# Altium project project_circuit_de_puissance.PrjPcb
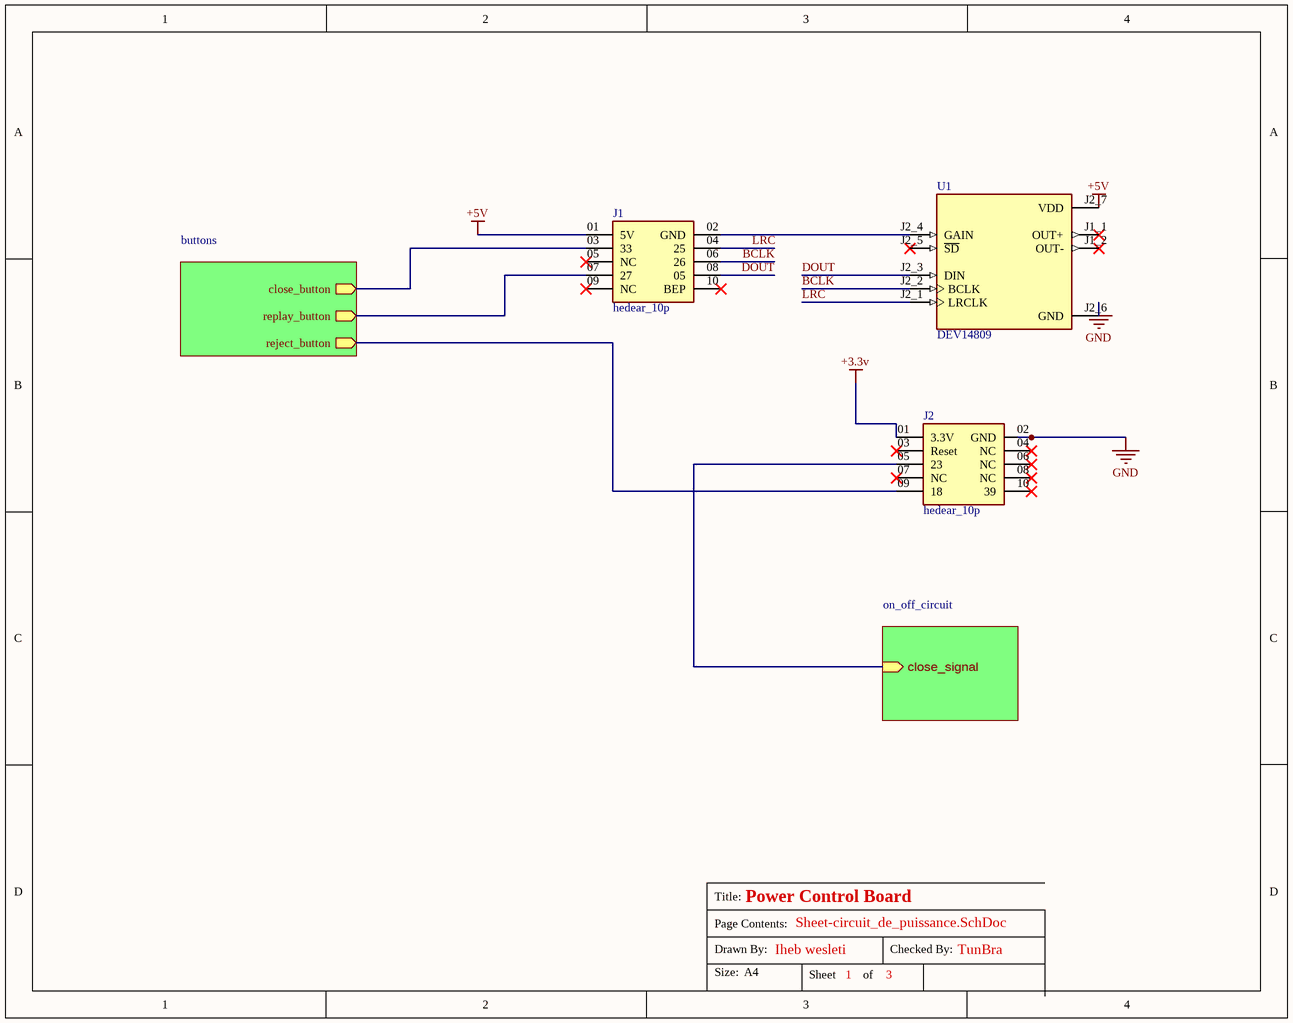
[diagram p0: Sheet-circuit_de_puissance.SchDoc]
3 sheets, 24 parts. Net scope: hierarchical (ports join the sheet entries above them; power ports are global).
Board file: pcb_circuit_de_puissance.PcbDoc
Sheets:
  Sheet-circuit_de_puissance.SchDoc
    on_off_circuit = circuit_on_off.SchDoc
    buttons = buttons.SchDoc

## Sheet Sheet-circuit_de_puissance.SchDoc: Power Control Board
size A; CheckedBy: TunBra; DrawnBy: Iheb wesleti; SheetNumber: 1; SheetTotal: 3; Number: 3

### Parts
J1  hedear_10p  [hedear10p]
J2  hedear_10p  [hedear10p]
U1  DEV14809  [MODULEson_DEV14809]

### Sub-sheets
buttons = buttons: close_button (out), replay_button (out), reject_button (out)
on_off_circuit = circuit_on_off: close_signal (in)

### Nets
+3.3v: J2.01(3.3V)
+5V: J1.01(5V) U1.J2_7(VDD)
GND: J2.02(GND) U1.J2_6(GND)
BCLK: J1.06(26) U1.J2_2(BCLK)
DOUT: J1.08(05) U1.J2_3(DIN)
LRC: J1.04(25) U1.J2_1(LRCLK)
NetC1_1: J1.03(33) ; sheet buttons/close_button
NetC3_2: J1.07(27) ; sheet buttons/replay_button
NetC4_2: J2.09(18) ; sheet buttons/reject_button
NetJ1_02: J1.02(GND) U1.J2_4(GAIN)
NetJ2_05: J2.05(23) ; sheet on_off_circuit/close_signal

Not connected (* = marked no-connect by the designer): J1 05(NC)* 09(NC)* 10(BEP)*; J2 03(Reset)* 04(NC)* 06(NC)* 07(NC)* 08(NC)* 10(39)*; U1 J1_1(OUT+)* J1_2(OUT-)* J2_5(~{SD})*

### Notes on the sheet
- Title:
- Size:
- Drawn By:
- Page Contents:
- A4
- Sheet
- of
- Checked By:
- 3

### Library data of the parts
J1 = hedear_10p: MP: TSS-105-02-L-D; Package: None; Price: None; Value: *; Availability: Unavailable
J2 = hedear_10p_1: MP: TSS-105-02-L-D; Package: None; Price: None; Value: *; Availability: Unavailable
U1 = DEV14809: MAX98357A Audio Interface Audio - Platform Evaluation Expansion Board; MF: Sparkfun Electronics; SnapEDA_Link: https://www.snapeda.com/parts/DEV14809/SparkFun+Electronics/view-part/?ref=snap; Package: None; Value: *; MP: DEV14809; Check_prices: https://www.snapeda.com/parts/DEV14809/SparkFun+Electronics/view-part/?ref=eda

## Sheet circuit_on_off.SchDoc: Power Control Board
size A; CheckedBy: TunBra; DrawnBy: Iheb Wesleti; SheetNumber: 2; SheetTotal: 3
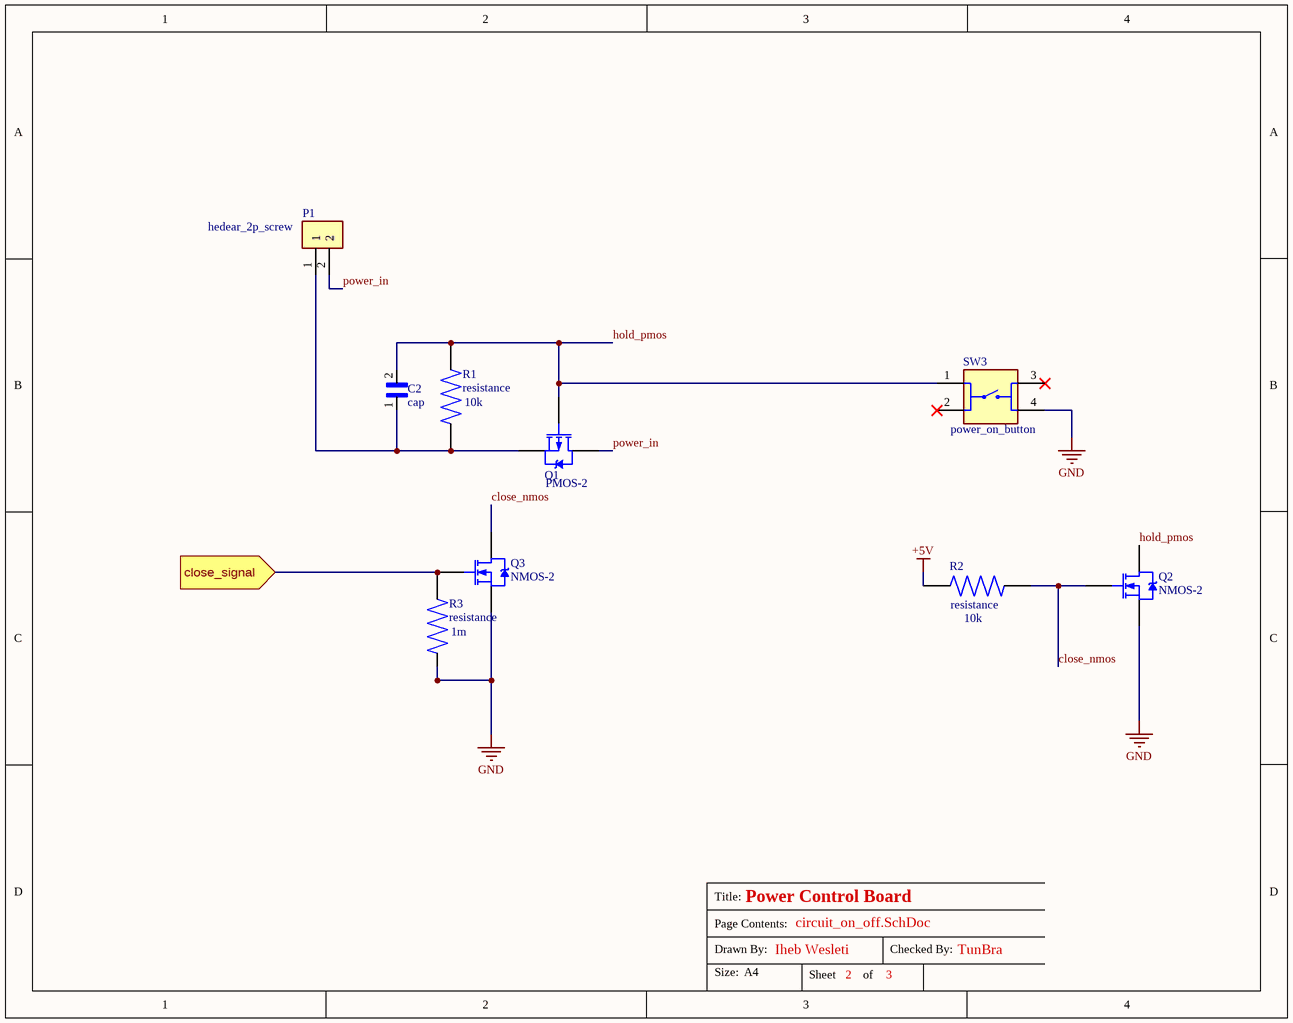
[diagram p1: circuit_on_off.SchDoc]

### Parts
C2  cap  [cap]
P1  hedear_2p_screw  [hedear_2p_screw]
Q1  PMOS-2  [TO-220AB]
Q2  NMOS-2  [TO-220AB]
Q3  NMOS-2  [TO-220AB]
R1  resistance  value 10k  [resistance]
R2  resistance  value 10k  [resistance]
R3  resistance  value 1m  [resistance]
SW3  power_on_button  [push_button_pcb]

### Ports
close_signal (in)

### Nets
+5V: R2.2
GND: Q2.3(S) Q3.3(S) R3.2 SW3.4
close_nmos: Q2.1(G) Q3.2(D) R2.1
hold_pmos: C2.2 Q1.1(G) Q2.2(D) R1.2 SW3.1
power_in: P1.2 Q1.2(D)
NetC2_1: C2.1 P1.1 Q1.3(S) R1.1
NetJ2_05: Q3.1(G) R3.1 ; port close_signal

Not connected (* = marked no-connect by the designer): SW3 2* 3*

### Notes on the sheet
- Title:
- Size:
- Drawn By:
- Page Contents:
- A4
- Sheet
- of
- Checked By:
- 3

### Library data of the parts
C2 = cap: Lead Capacitor X7R_EIA_ with Capacitance: 0.10F and Rated Voltage: 1000Vdc; MF: Murata; MP: RDER73A104K5E1H03A; Value: *; Price: None; SnapEDA_Link: https://www.snapeda.com/parts/RDER73A104K5E1H03A/Murata/view-part/4545952/?ref=snap; Package: Radial Murata; Availability: Unavailable
P1 = hedear_2p_screw: MF: TE Connectivity; MP: 282837-2; SnapEDA_Link: https://www.snapeda.com/parts/282837-2/TE+Connectivity+AMP+Connectors/view-part/?ref=snap; Price: None; Check_prices: https://www.snapeda.com/parts/282837-2/TE+Connectivity+AMP+Connectors/view-part/?ref=eda; Purchase-URL: https://pricing.snapeda.com/search/part/282837-2/?ref=eda; Value: *; Availability: In Stock; Package: None
Q1 = PMOS-2: P-Channel Power MOSFET; Note: Pin 4 not drawn and electrically connected to Pin 2.; Published: 8-Jun-2000; LatestRevisionDate: 17-Jul-2002; LatestRevisionNote: Re-released for DXP Platform.; DatasheetVersion: PD-9.390D; PackageVersion: Feb-1997; PackageReference: TO-220AB; Publisher: Altium Limited; PackageDescription: TO, Thru-Hole, Vertical, Heatsink Mounted; 3 In-Line Leads; Pitch 2.54 mm; ComponentLink1Description: Manufacturer Link; ComponentLink1URL: http://www.irf.com/
Q2 Q3 = NMOS-2: N-Channel Power MOSFET; Note: Pin 2 is electrically connected to pin 4.; Published: 8-Jun-2000; LatestRevisionDate: 17-Jul-2002; LatestRevisionNote: Re-released for DXP Platform.; DatasheetVersion: PD-9.814; PackageVersion: Feb-1997; PackageReference: TO-220AB; Publisher: Altium Limited; PackageDescription: TO, Thru-Hole, Vertical, Heatsink Mounted; 3 In-Line Leads; Pitch 2.54 mm; ComponentLink1Description: Manufacturer Link; ComponentLink1URL: http://www.irf.com/
R1-R3 = resistance: MP: CBT50J5R1; MF: TE Connectivity / AMP; Price: None; Availability: In Stock; Package: Axial TE Connectivity / AMP; SnapEDA_Link: https://www.snapeda.com/parts/CBT50J5R1/TE+Connectivity+%252F+AMP/view-part/?ref=snap; Purchase-URL: https://pricing.snapeda.com/search/part/CBT50J5R1/?ref=eda; Check_prices: https://www.snapeda.com/parts/CBT50J5R1/TE+Connectivity+%252F+AMP/view-part/?ref=eda
SW3 = push_button: Switch Push Button OFF (ON) SPST Round Button 0.05A 24VDC Momentary Contact PC Pins Thru-Hole; MP: 1825910-6; MF: TE Connectivity; Value: *; Package: None; Check_prices: https://www.snapeda.com/parts/1825910-6/TE+Connectivity+ALCOSWITCH+Switches/view-part/?ref=eda; SnapEDA_Link: https://www.snapeda.com/parts/1825910-6/TE+Connectivity+ALCOSWITCH+Switches/view-part/?ref=snap; Digi-Key_Part_Number: 450-1650-ND; Purchase-URL: https://pricing.snapeda.com/search/part/1825910-6/?ref=eda

## Sheet buttons.SchDoc: Power Control Board
size A; CheckedBy: TunBra; DrawnBy: Iheb Wesleti; SheetNumber: 3; SheetTotal: 3
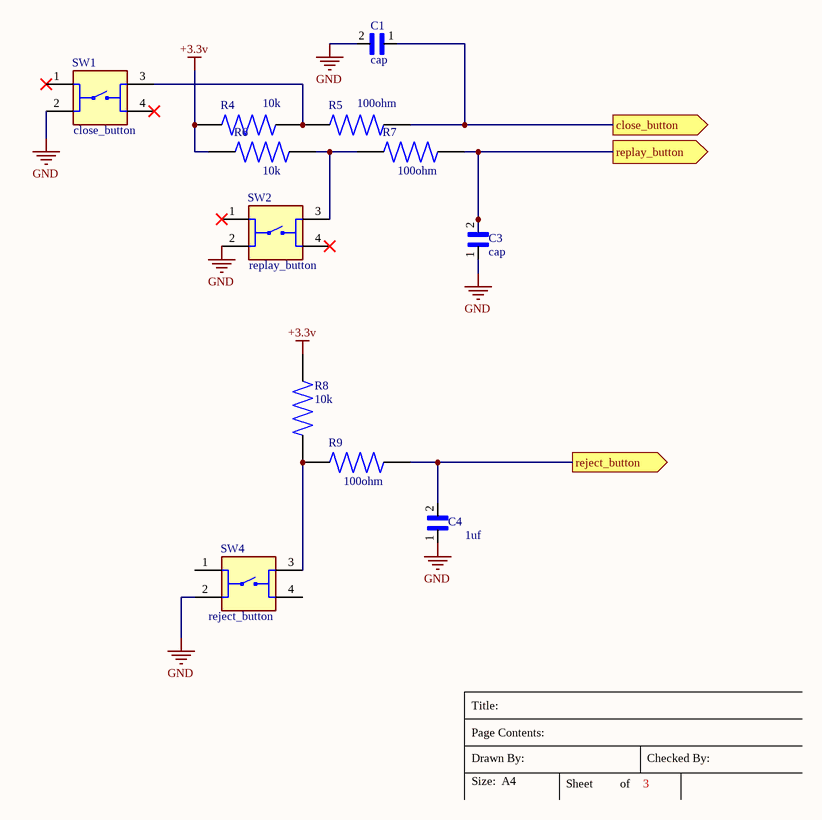
[diagram p2: buttons.SchDoc]

### Parts
C1  cap  [cap]
C3  cap  [cap]
C4  value 1uf  [cap]  (hidden comment: cap)
R4  value 10k  [resistance]  (hidden comment: resistance)
R5  value 100ohm  [resistance]  (hidden comment: resistance)
R6  value 10k  [resistance]  (hidden comment: resistance)
R7  value 100ohm  [resistance]  (hidden comment: resistance)
R8  value 10k  [resistance]  (hidden comment: resistance)
R9  value 100ohm  [resistance]  (hidden comment: resistance)
SW1  close_button  [push_button_pcb]
SW2  replay_button  [push_button_pcb]
SW4  reject_button  [push_button_pcb]

### Ports
close_button (out), reject_button (out), replay_button (out)

### Nets
+3.3v: R4.2 R6.2 R8.1
GND: C1.2 C3.1 C4.1 SW1.2 SW2.2 SW4.2
NetC1_1: C1.1 R5.1 ; port close_button
NetC3_2: C3.2 R7.1 ; port replay_button
NetC4_2: C4.2 R9.1 ; port reject_button
NetR4_1: R4.1 R5.2 SW1.3
NetR6_1: R6.1 R7.2 SW2.3
NetR8_2: R8.2 R9.2 SW4.3

Not connected (* = marked no-connect by the designer): SW1 1* 4*; SW2 1* 4*; SW4 1 4

### Notes on the sheet
- Title:
- Size:
- Drawn By:
- Page Contents:
- A4
- Sheet
- of
- Checked By:
- 3

### Library data of the parts
C1 C3 C4 = cap: as C2 on sheet circuit_on_off; Price: None; SnapEDA_Link: https://www.snapeda.com/parts/RDER73A104K5E1H03A/Murata/view-part/4545952/?ref=snap; Package: Radial Murata; Availability: Unavailable
  C1 C3: Value: *
R4-R9 = resistance: MP: CBT50J5R1; MF: TE Connectivity / AMP; Price: None; Availability: In Stock; Package: Axial TE Connectivity / AMP; SnapEDA_Link: https://www.snapeda.com/parts/CBT50J5R1/TE+Connectivity+%252F+AMP/view-part/?ref=snap; Purchase-URL: https://pricing.snapeda.com/search/part/CBT50J5R1/?ref=eda; Check_prices: https://www.snapeda.com/parts/CBT50J5R1/TE+Connectivity+%252F+AMP/view-part/?ref=eda
SW1 SW2 SW4 = push_button: as SW3 on sheet circuit_on_off; Value: *; Package: None; Check_prices: https://www.snapeda.com/parts/1825910-6/TE+Connectivity+ALCOSWITCH+Switches/view-part/?ref=eda; SnapEDA_Link: https://www.snapeda.com/parts/1825910-6/TE+Connectivity+ALCOSWITCH+Switches/view-part/?ref=snap; Digi-Key_Part_Number: 450-1650-ND; Purchase-URL: https://pricing.snapeda.com/search/part/1825910-6/?ref=eda

## Nets that join several sheets
+3.3v: Sheet-circuit_de_puissance (J2.01), buttons (R4.2 R6.2 R8.1)
+5V: Sheet-circuit_de_puissance (J1.01 U1.J2_7), circuit_on_off (R2.2)
GND: Sheet-circuit_de_puissance (J2.02 U1.J2_6), circuit_on_off (Q2.3 Q3.3 R3.2 SW3.4), buttons (6 pins)
NetC1_1: Sheet-circuit_de_puissance (J1.03), buttons (C1.1 R5.1)
NetC3_2: Sheet-circuit_de_puissance (J1.07), buttons (C3.2 R7.1)
NetC4_2: Sheet-circuit_de_puissance (J2.09), buttons (C4.2 R9.1)
NetJ2_05: Sheet-circuit_de_puissance (J2.05), circuit_on_off (Q3.1 R3.1)